# Altium schematic sheet MainPower & Regulation.SchDoc: LOAD CONTROL
size A4; SheetNumber: 5; SheetTotal: 5; DOC_NO_SCH_DWG: #032024040604
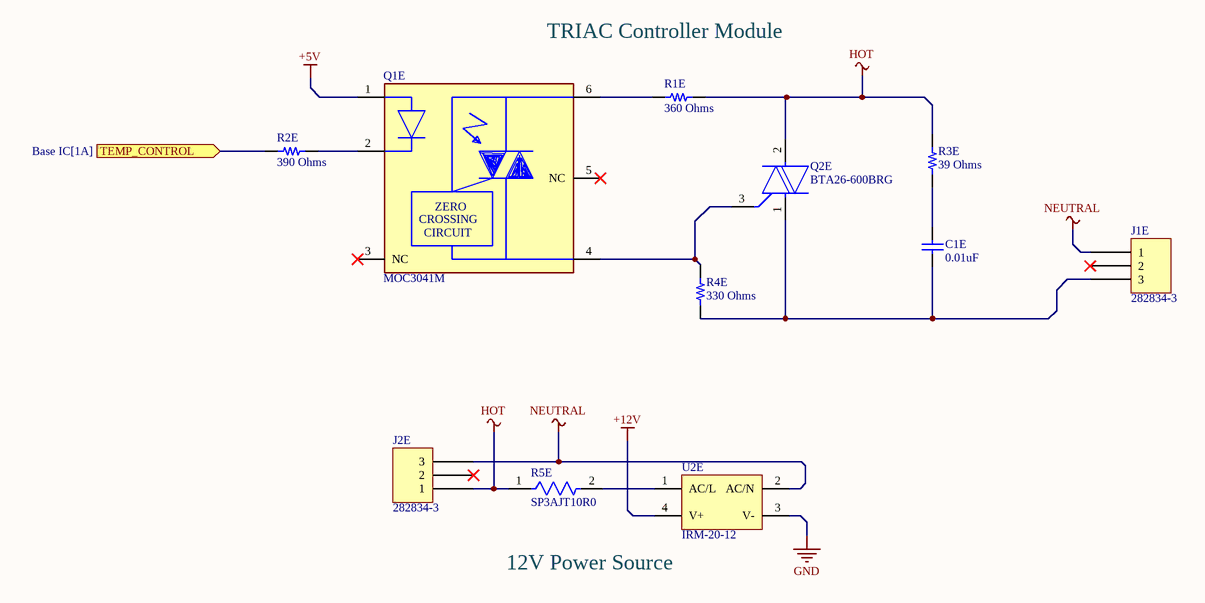
[diagram p0: MainPower & Regulation.SchDoc]

## Parts
C1E  0.01uF  [WCAP-FTXX_L13W5H11_CS]
J1E  282834-3  [TE 282834-3]
J2E  282834-3  [TE 282834-3]
Q1E  MOC3041M  [FP-646BX-MFG]
Q2E  BTA26-600BRG  [BTA26-600BRG]
R1E  360 Ohms  [RES 2512_6432]
R2E  390 Ohms  [RES 0402_1005]
R3E  39 Ohms  [RES 2512_6432]
R4E  330 Ohms  [RES 2512_6432]
R5E  SP3AJT10R0  [FP-SP3A-MFG]
U2E  IRM-20-12  [MEANW-IRM-20-12]

## Ports
TEMP_CONTROL (in, see Base IC[1A])

## Nets
+5V: Q1E.1(A)
+12V: U2E.4(V+)
GND: U2E.3(V-)
HOT: J2E.1 Q2E.2(A2) R1E.2 R3E.2 R5E.1
NEUTRAL: J1E.1 J2E.3 U2E.2(AC/N)
TEMP_CONTROL: R2E.1 ; port TEMP_CONTROL
NetC1E_1: C1E.1 J1E.3 Q2E.1(A1) R4E.1
NetC1E_2: C1E.2 R3E.1
NetQ1E_2: Q1E.2(C) R2E.2
NetQ1E_4: Q1E.4(1_MAIN_TERM.) Q2E.3(G) R4E.2
NetQ1E_6: Q1E.6(2_MAIN_TERM.) R1E.1
NetR5E_2: R5E.2 U2E.1(AC/L)

Not connected (* = marked no-connect by the designer): J1E 2*; J2E 2*; Q1E 3(NC)* 5(NC)*

## Notes on the sheet
- TRIAC Controller Module
- (near U2E) 12V Power Source
- THIS DOCUMENT AND THE DATA DISCLOSED HEREIN OR
- HEREWITH IS THE PROPERTY OF SPD Ind.
- ENG:
- DHARAGESWARAN S
- APPROVALS
- DATE
- PROJECT
- DSN:
- CHK:
- REFERENCE DOCUMENTS
- PROJECT REVISION:
- TITLE
- DOCUMENT REVISION:
- Email: sdhamuvkl@gmail.com <https://github.com/DhamuVkl>
- BOM:
- FAB DWG:
- PCB DWG:
- ASSY DWG:
- SCALE:
- A4
- SIZE
- CAGE CODE
- FILE NAME
- DWG NO.
- SHEET
- REV
- OF
- (in symbol CMP-07144-000005-1) ZERO; CROSSING; CIRCUIT

## Library data of the parts
C1E = CMP-03913-51400137-2: 890334023006CS WCAP-FTXX Film Capacitor 10nF 310Vac; Dielectric: PP; Pin Length: 4mm; Tolerance: 10%; Pitch: 10mm; Voltage Rating (AC): 310V; Insulation Resistance: 30GΩ; Hole Diameter: 900µm; Max Operating Temperature: 105°C; Min Operating Temperature: -40°C; Capacitance: 10nF; Termination: PC Pins; Packaging: Carton; Height - Seated (Max): 11.5062mm; RoHS: Compliant; Length: 13mm; Lead Pitch: 10.0076mm; NexarPartId: 51400137; Case/Package: Radial; Width: 5mm; Mount: Through Hole; Dielectric Material: PP; Voltage Rating: 310V; Voltage Rating (DC): 310V; Height: 11mm; REACH SVHC: Unknown
J1E J2E = 282834-3: TERM BLK 3P SIDE ENT 2.54MM PCB; Manufacturer: TE Connectivity AMP Connectors; id: 2; Wire Gauge: 16-30 AWG; Voltage: 150V; Positions Per Level: 3; Number Of Levels: 1; Pitch: 0.100" (2.54mm); Mating Orientation: Horizontal with Board; Wire Termination: Screw - Rising Cage Clamp; Current: 10A; Part Number: 282834-3; Supplier Part Number 1: A98334-ND; ComponentLink1Description: Datasheet; Color: Green; ComponentLink2URL: http://digikey.com/product-detail/en/te-connectivity-amp-connectors/282834-3/A98334-ND/1153264; ComponentLink1URL: https://www.te.com/commerce/DocumentDelivery/DDEController?Action=srchrtrv&DocNm=282834&DocType=Customer+Drawing&DocLang=English; Supplier 1: DigiKey; Series: Buchanan; Part Status: Active; ComponentLink2Description: DigiKey Link; Packaging: Bulk; Minimum Order: 1; Lifecycle Status: Active; LastUpdated: 2020-01-15T04:15:50.317; Mounting Type: Through Hole; Price: 2.01
Q1E = CMP-07144-000005-1: OPTOISOLATOR 4.17KV TRIAC 6DIP; Manufacturer: ON Semiconductor; Forward Voltage: 1.25V; Power Dissipation: 250mW; Forward Current: 30mA; Reverse Voltage: 6V; Max Junction Temp: +100°C; Isolation Voltage: 4170Vrms; Standoff Height: 0.38mm; Octopart: https://octopart.com/moc3041m-on+semiconductor-84330395; Temperature Range Low: -40°C; Category: Trans; Package: 646BX; Height: 5.08mm; Manufacturer Part Number: MOC3041M; ComponentLink2Description: Datasheet; Device Class L2: Optocouplers; Device Class L1: Optoelectronics; Device Class L3: unset; Automotive: No; RoHS: TRUE; Mouser Description: Optocoupler Triac AC Output 1 Channel 400VDRM 6-Pin Plastic Dip White Bulk; Temperature: -40°C to +85°C; Lead Free: Yes; ComponentLink2URL: https://www.onsemi.com/pub/Collateral/MOC3043M-D.pdf; Digikey Description: OPTOISOLATOR 4.17KV TRIAC 6DIP; Temperature Range High: +85°C; Footprint Url: https://www.onsemi.com/pub/Collateral/646BX.PDF
R1E = RK73B3ATTE361J: RES 360 OHM 5% 1W 2512; Manufacturer: KOA Speer Electronics, Inc.; id: 708; Temperature Coefficient: ±200ppm/°C; Part Number: RK73B3ATTE361J; Height - Seated (Max): 0.028" (0.70mm); Supplier Part Number 1: 2019-RK73B3ATTE361JCT-ND; Supplier Device Package: 2512; ComponentLink1Description: Datasheet; ComponentLink2URL: http://digikey.com/product-detail/en/koa-speer-electronics-inc/RK73B3ATTE361J/2019-RK73B3ATTE361JCT-ND/10425443; Features: Automotive AEC-Q200, Moisture Resistant; ComponentLink1URL: http://www.koaspeer.com/catimages/Products/RK73B/RK73B.pdf; Composition: Thick Film; Tolerance: ±5%; Supplier 1: DigiKey; Series: RK73B; Part Status: Active; ComponentLink2Description: DigiKey Link; Device Package: 2512 (6432 Metric); Packaging: TapeAndReel; Ratings: AEC-Q200; Minimum Order: 1; Package / Case: 2512 (6432 Metric); Lifecycle Status: Active; LastUpdated: 2020-09-02T01:26:53.140; Operating Temperature: -55°C ~ 155°C; Number Of Terminations: 2; Value: 360 Ohms; Size / Dimension: 0.248" L x 0.122" W (6.30mm x 3.10mm); Power (Watts): 1W; Price: 0.04; Resistance: 360 Ohms
R2E = CR0402-FX-3900GLF: RES SMD 390 OHM 1% 1/16W 0402; Manufacturer: Bourns Inc.; id: 5421; Temperature Coefficient: ±100ppm/°C; Power (Watts): 0.063W, 1/16W; Part Number: CR0402-FX-3900GLF; Height - Seated (Max): 0.016" (0.40mm); Supplier Part Number 1: CR0402-FX-3900GLFCT-ND; Supplier Device Package: 0402; ComponentLink1Description: Datasheet; ComponentLink2URL: https://www.digikey.com/en/products/detail/bourns-inc/CR0402-FX-3900GLF/3783350; ComponentLink1URL: https://www.bourns.com/docs/Product-Datasheets/CR0402.pdf; Composition: Thick Film; Tolerance: ±1%; Supplier 1: DigiKey; Series: CR0402; Part Status: Active; ComponentLink2Description: DigiKey Link; Device Package: 0402 (1005 Metric); Packaging: CutTape; Minimum Order: 1; Package / Case: 0402 (1005 Metric); PartId: 12887; Lifecycle Status: Active; LastUpdated: 2023-01-02T20:21:06.287; Operating Temperature: -55°C ~ 155°C; Number Of Terminations: 2; Value: 390 Ohms; Size / Dimension: 0.039" L x 0.020" W (1.00mm x 0.50mm); Price: 0.01; Resistance: 390 Ohms
R3E = RK73B3ATTE390J: RES 39 OHM 5% 1W 2512; Manufacturer: KOA Speer Electronics, Inc.; id: 296; Temperature Coefficient: ±200ppm/°C; Part Number: RK73B3ATTE390J; Height - Seated (Max): 0.028" (0.70mm); Supplier Part Number 1: 2019-RK73B3ATTE390JCT-ND; Supplier Device Package: 2512; ComponentLink1Description: Datasheet; ComponentLink2URL: http://digikey.com/product-detail/en/koa-speer-electronics-inc/RK73B3ATTE390J/2019-RK73B3ATTE390JCT-ND/10425325; Features: Automotive AEC-Q200, Moisture Resistant; ComponentLink1URL: http://www.koaspeer.com/catimages/Products/RK73B/RK73B.pdf; Composition: Thick Film; Tolerance: ±5%; Supplier 1: DigiKey; Series: RK73B; Part Status: Active; ComponentLink2Description: DigiKey Link; Device Package: 2512 (6432 Metric); Packaging: TapeAndReel; Ratings: AEC-Q200; Minimum Order: 1; Package / Case: 2512 (6432 Metric); Lifecycle Status: Active; LastUpdated: 2023-01-02T21:07:20.787; Operating Temperature: -55°C ~ 155°C; Number Of Terminations: 2; Value: 39 Ohms; Size / Dimension: 0.248" L x 0.122" W (6.30mm x 3.10mm); Power (Watts): 1W; Price: 0.04; Resistance: 39 Ohms
R4E = RK73H3ATTE3300F: RES 330 OHM 1% 1W 2512; Manufacturer: KOA Speer Electronics, Inc.; id: 684; Temperature Coefficient: ±100ppm/°C; Part Number: RK73H3ATTE3300F; Height - Seated (Max): 0.028" (0.70mm); Supplier Part Number 1: 2019-RK73H3ATTE3300FCT-ND; Supplier Device Package: 2512; ComponentLink1Description: Datasheet; ComponentLink2URL: http://digikey.com/product-detail/en/koa-speer-electronics-inc/RK73H3ATTE3300F/2019-RK73H3ATTE3300FCT-ND/10425036; Features: Automotive AEC-Q200, Moisture Resistant; ComponentLink1URL: http://www.koaspeer.com/catimages/Products/RK73H/RK73H.pdf; Composition: Thick Film; Tolerance: ±1%; Supplier 1: DigiKey; Series: RK73H; Part Status: Active; ComponentLink2Description: DigiKey Link; Device Package: 2512 (6432 Metric); Packaging: TapeAndReel; Ratings: AEC-Q200; Minimum Order: 1; Package / Case: 2512 (6432 Metric); Lifecycle Status: Active; LastUpdated: 2020-09-02T01:26:53.040; Operating Temperature: -55°C ~ 155°C; Number Of Terminations: 2; Value: 330 Ohms; Size / Dimension: 0.248" L x 0.122" W (6.30mm x 3.10mm); Power (Watts): 1W; Price: 0.05; Resistance: 330 Ohms
R5E = CMP-26528-000004-1: RES 10 OHM 5% 4W AXIAL; Resistance: 10R; Temperature Coefficient: 20ppm/°C; Power Rating: 4W; Series: SP; Mount: Through Hole; Diameter: 5.5mm; RoHS Compliant: Yes; Length: 12.7mm; Max Operating Temperature: 350°C; Max Power Dissipation: 4W; Number of Terminations: 2; Resistor Type: Wirewound; Min Operating Temperature: -55°C; Case/Package: Axial; Tolerance: 5%; Package Quantity: 1; Packaging: Cut Tape
U2E = CMP-2000-07460-1: Single Output Encapsulated Type, 12 V, 1.8 A, 21.6 W, -40 to 85 degC, 4-Pin THD, RoHS; Manufacturer: Mean Well; Output Current: 1.8A; Output Power: 21.6W; Voltage - Output 1: 12V; Efficiency: 84%; Approvals: CB; Number of Outputs: 1; Length: 53mm; RoHSCompliant: true; Lead Free: LeadFree; Packaging: Bulk; Package Description: 4-Pin Through Hole Device, Body 52.4 x 27.2 mm, Height 24 mm; Number of Pins: 4; Mount: ThroughHole; Min Operating Temperature: -30degC; Manufacturer URL: http://www.meanwellusa.com/; Weight: 2.081164oz; Package Quantity: 240; Package Reference: IRM-20-12-4; Datasheet URL: http://datasheet.octopart.com/IRM-20-12-Mean-Well-datasheet-42021592.pdf; Max Output Power: 21.6W; Max Operating Temperature: 70degC; Height: 24mm; Mounting Technology: ThroughHole; Datasheet Version: 06/2015; Current - Output 1: 1.8A; Width: 28mm
Q2E = BTA26-600BRG: Supplier 1: Future Electronics; Supplier Part Number 1: 1404508